# Altium schematic sheet 电调.SchDoc
size A3; SheetNumber: 1; SheetTotal: 1
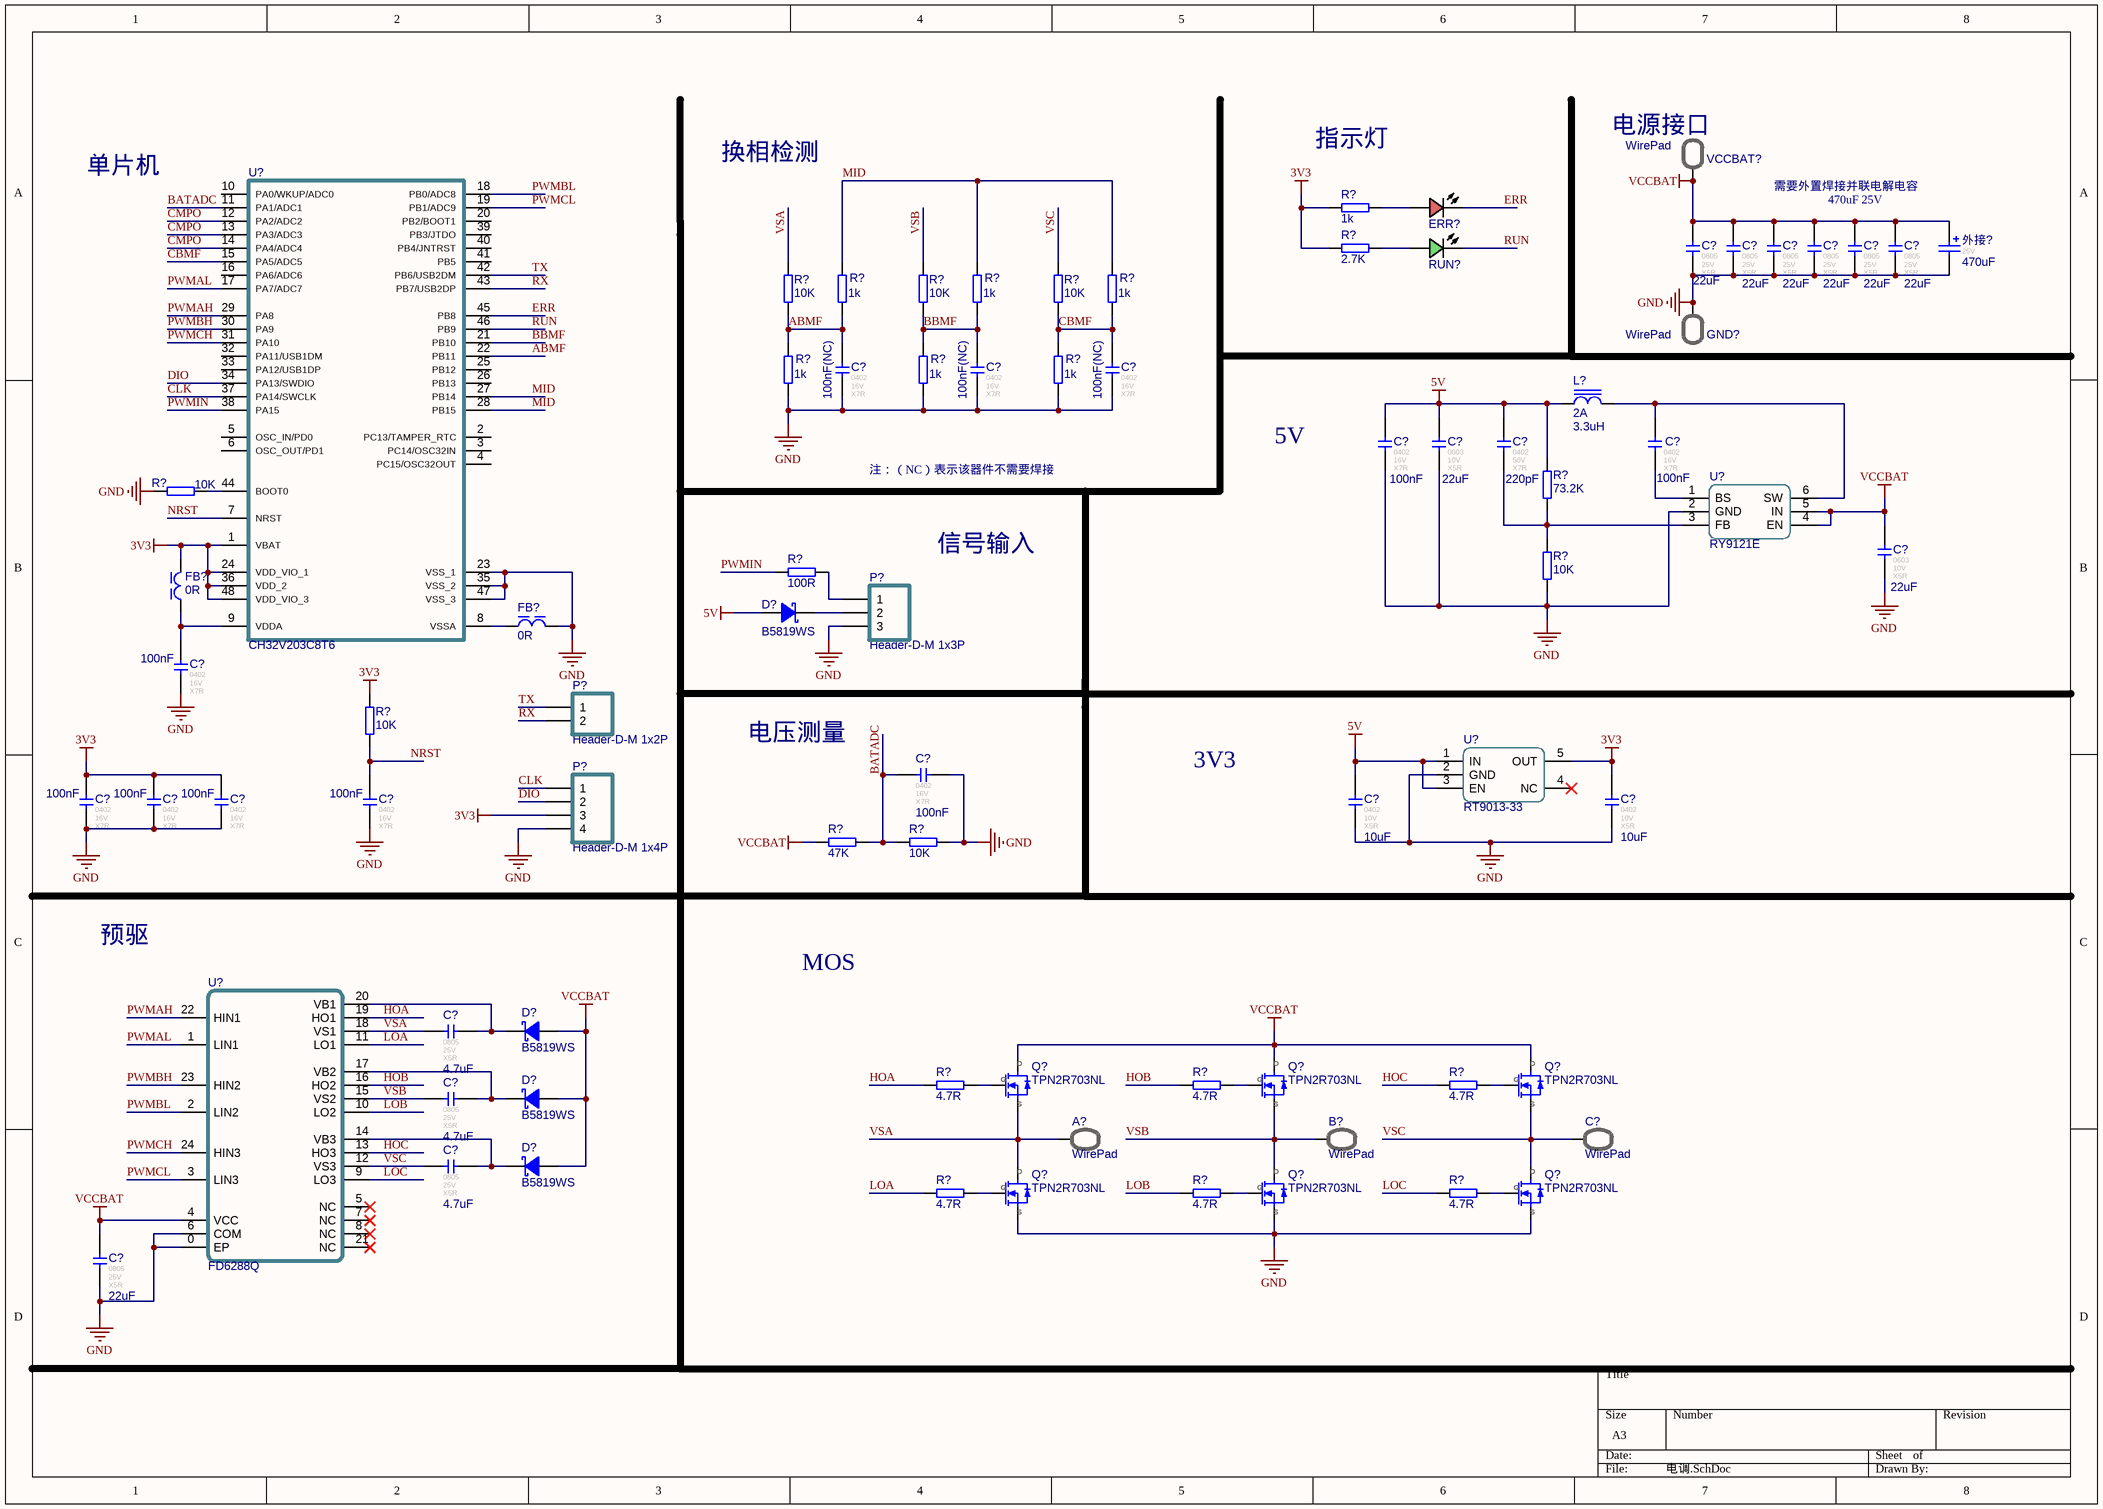
[diagram p0: 电调.SchDoc]

## Parts
(Parts that share a designator on the sheet are numbered #1, #2 ... from top to bottom, then left to right.)
A?  WirePad  [WirePad]  (no BOM)
B?  WirePad  [WirePad]  (no BOM)
C?#1  value 22uF  FootPrint: 0805  Voltage: 25V  Type: X5R  [CAPC2012[0805]S-L]  (hidden comment: 22uF 25V X5R)
C?#2  value 22uF  FootPrint: 0805  Voltage: 25V  Type: X5R  [CAPC2012[0805]S-L]  (hidden comment: 22uF 25V X5R)
C?#3  value 22uF  FootPrint: 0805  Voltage: 25V  Type: X5R  [CAPC2012[0805]S-L]  (hidden comment: 22uF 25V X5R)
C?#4  value 22uF  FootPrint: 0805  Voltage: 25V  Type: X5R  [CAPC2012[0805]S-L]  (hidden comment: 22uF 25V X5R)
C?#5  value 22uF  FootPrint: 0805  Voltage: 25V  Type: X5R  [CAPC2012[0805]S-L]  (hidden comment: 22uF 25V X5R)
C?#6  value 22uF  FootPrint: 0805  Voltage: 25V  Type: X5R  [CAPC2012[0805]S-L]  (hidden comment: 22uF 25V X5R)
C?#7  value 100nF(NC)  FootPrint: 0402  Voltage: 16V  Type: X7R  [CAPC1005[0402]S-L]  (hidden comment: 100nF(NC) 16V X7R)
C?#8  value 100nF(NC)  FootPrint: 0402  Voltage: 16V  Type: X7R  [CAPC1005[0402]S-L]  (hidden comment: 100nF(NC) 16V X7R)
C?#9  value 100nF(NC)  FootPrint: 0402  Voltage: 16V  Type: X7R  [CAPC1005[0402]S-L]  (hidden comment: 100nF(NC) 16V X7R)
C?#10  value 100nF  FootPrint: 0402  Voltage: 16V  Type: X7R  [CAPC1005[0402]S-L]  (hidden comment: 100nF 16V X7R)
C?#11  value 22uF  FootPrint: 0603  Voltage: 10V  Type: X5R  [CAPC1608[0603]S-L]  (hidden comment: 22uF 10V X5R)
C?#12  value 220pF  FootPrint: 0402  Voltage: 50V  Type: X7R  [CAPC1005[0402]S-L]  (hidden comment: 220pF 50V X7R)
C?#13  value 100nF  FootPrint: 0402  Voltage: 16V  Type: X7R  [CAPC1005[0402]S-L]  (hidden comment: 100nF 16V X7R)
C?#14  value 22uF  FootPrint: 0603  Voltage: 10V  Type: X5R  [CAPC1608[0603]S-L]  (hidden comment: 22uF 10V X5R)
C?#15  value 100nF  FootPrint: 0402  Voltage: 16V  Type: X7R  [CAPC1005[0402]S-L]  (hidden comment: 100nF 16V X7R)
C?#16  value 100nF  FootPrint: 0402  Voltage: 16V  Type: X7R  [CAPC1005[0402]S-L]  (hidden comment: 100nF 16V X7R)
C?#17  value 100nF  FootPrint: 0402  Voltage: 16V  Type: X7R  [CAPC1005[0402]S-L]  (hidden comment: 100nF 16V X7R)
C?#18  value 100nF  FootPrint: 0402  Voltage: 16V  Type: X7R  [CAPC1005[0402]S-L]  (hidden comment: 100nF 16V X7R)
C?#19  value 100nF  FootPrint: 0402  Voltage: 16V  Type: X7R  [CAPC1005[0402]S-L]  (hidden comment: 100nF 16V X7R)
C?#20  value 100nF  FootPrint: 0402  Voltage: 16V  Type: X7R  [CAPC1005[0402]S-L]  (hidden comment: 100nF 16V X7R)
C?#21  value 10uF  FootPrint: 0402  Voltage: 10V  Type: X5R  [CAPC1005[0402]S-L]  (hidden comment: 10uF 10V X5R)
C?#22  value 10uF  FootPrint: 0402  Voltage: 10V  Type: X5R  [CAPC1005[0402]S-L]  (hidden comment: 10uF 10V X5R)
C?#23  value 4.7uF  FootPrint: 0805  Voltage: 25V  Type: X5R  [CAPC2012[0805]S-L]  (hidden comment: 4.7uF 25V X5R)
C?#24  value 4.7uF  FootPrint: 0805  Voltage: 25V  Type: X5R  [CAPC2012[0805]S-L]  (hidden comment: 4.7uF 25V X5R)
C?#25  WirePad  [WirePad]  (no BOM)
C?#26  value 4.7uF  FootPrint: 0805  Voltage: 25V  Type: X5R  [CAPC2012[0805]S-L]  (hidden comment: 4.7uF 25V X5R)
C?#27  value 22uF  FootPrint: 0805  Voltage: 25V  Type: X5R  [CAPC2012[0805]S-L]  (hidden comment: 22uF 25V X5R)
D?#1  B5819WS  [SOD-323]
D?#2  B5819WS  [SOD-323]
D?#3  B5819WS  [SOD-323]
D?#4  B5819WS  [SOD-323]
ERR?  红色贴片LED  [LEDC1608(0603)-L]  (value not drawn)
FB?#1  value 0R  [INDC1005[0402]S]  (hidden comment: 0R @100MHz 500mA)
FB?#2  value 0R  [INDC1005[0402]S]  (hidden comment: 0R @100MHz 500mA)
GND?  WirePad  [WirePad]  (no BOM)
L?  value 3.3uH  Imax: 2A  [SLO2520]  (hidden comment: 3.3uH 2A)
P?#1  Header-D-M 1x3P  [HEADER1X3]
P?#2  Header-D-M 1x2P  [HEADER1X2]  (no BOM)
P?#3  Header-D-M 1x4P  [HDR1X4-TP-NS]  (no BOM)
Q?#1  TPN2R703NL  [TSON3x3]
Q?#2  TPN2R703NL  [TSON3x3]
Q?#3  TPN2R703NL  [TSON3x3]
Q?#4  TPN2R703NL  [TSON3x3]
Q?#5  TPN2R703NL  [TSON3x3]
Q?#6  TPN2R703NL  [TSON3x3]
R?#1  value 1k  [RESC1005[0402]S-L]  (hidden comment: 1k ±1%)
R?#2  value 2.7K  [RESC1005[0402]S-L]  (hidden comment: 2.7K ±1%)
R?#3  value 10K  [RESC1005[0402]S-L]  (hidden comment: 10K ±1%)
R?#4  value 1k  [RESC1005[0402]S-L]  (hidden comment: 1k ±1%)
R?#5  value 10K  [RESC1005[0402]S-L]  (hidden comment: 10K ±1%)
R?#6  value 1k  [RESC1005[0402]S-L]  (hidden comment: 1k ±1%)
R?#7  value 10K  [RESC1005[0402]S-L]  (hidden comment: 10K ±1%)
R?#8  value 1k  [RESC1005[0402]S-L]  (hidden comment: 1k ±1%)
R?#9  value 1k  [RESC1005[0402]S-L]  (hidden comment: 1k ±1%)
R?#10  value 1k  [RESC1005[0402]S-L]  (hidden comment: 1k ±1%)
R?#11  value 1k  [RESC1005[0402]S-L]  (hidden comment: 1k ±1%)
R?#12  value 10K  [RESC1005[0402]S-L]  (hidden comment: 10K ±1%)
R?#13  value 73.2K  [RESC1005[0402]S-L]  (hidden comment: 73.2K ±1%)
R?#14  value 100R  [RESC1005[0402]S-L]  (hidden comment: 100R ±1%)
R?#15  value 10K  [RESC1005[0402]S-L]  (hidden comment: 10K ±1%)
R?#16  value 10K  [RESC1005[0402]S-L]  (hidden comment: 10K ±1%)
R?#17  value 47K  [RESC1005[0402]S-L]  (hidden comment: 47K ±1%)
R?#18  value 10K  [RESC1005[0402]S-L]  (hidden comment: 10K ±1%)
R?#19  value 4.7R  [RESC1005[0402]S-L]  (hidden comment: 4.7R ±1%)
R?#20  value 4.7R  [RESC1005[0402]S-L]  (hidden comment: 4.7R ±1%)
R?#21  value 4.7R  [RESC1005[0402]S-L]  (hidden comment: 4.7R ±1%)
R?#22  value 4.7R  [RESC1005[0402]S-L]  (hidden comment: 4.7R ±1%)
R?#23  value 4.7R  [RESC1005[0402]S-L]  (hidden comment: 4.7R ±1%)
R?#24  value 4.7R  [RESC1005[0402]S-L]  (hidden comment: 4.7R ±1%)
RUN?  翠绿贴片LED  [LEDC1608(0603)-L]  (value not drawn)
U?#1  CH32V203C8T6  [LQFP48_L]
U?#2  RY9121E  [SOT-23-6]
U?#3  RT9013-33  [SOT-23-5]
U?#4  FD6288Q  [QFN24-4x4]
VCCBAT?  WirePad  [WirePad]  (no BOM)
外接?  value 470uF  Voltage: 25V  [Cap-S-D 3.5-8x14-S]  (hidden comment: 470uF 25V 聚合物固态)

## Nets
3V3: C?#17.2 C?#18.2 C?#19.2 C?#22.2 FB?#1.2 P?#3.3 R?#1.1 R?#2.1 R?#16.2 U?#1.1(VBAT) U?#1.24(VDD_VIO_1) U?#1.36(VDD_2) U?#1.48(VDD_VIO_3) U?#3.5(OUT)
5V: C?#10.2 C?#11.2 C?#12.2 C?#21.2 D?#1.A L?.1 R?#13.2 U?#3.1(IN) U?#3.3(EN)
GND: C?#1.1 C?#2.1 C?#3.1 C?#4.1 C?#5.1 C?#6.1 C?#7.1 C?#8.1 C?#9.1 C?#10.1 C?#11.1 C?#14.1 C?#15.1 C?#16.1 C?#17.1 C?#18.1 C?#19.1 C?#20.1 C?#21.1 C?#22.1 C?#27.1 FB?#2.2 GND?.1 P?#1.3 P?#3.4 Q?#4.3(S) Q?#5.3(S) Q?#6.3(S) R?#9.1 R?#10.1 R?#11.1 R?#12.1 R?#15.1 R?#18.1 U?#1.23(VSS_1) U?#1.35(VSS_2) U?#1.47(VSS_3) U?#2.2(GND) U?#3.2(GND) U?#4.0(EP) U?#4.6(COM) 外接?.2
VCCBAT: C?#1.2 C?#2.2 C?#3.2 C?#4.2 C?#5.2 C?#6.2 C?#14.2 C?#27.2 D?#2.A D?#3.A D?#4.A Q?#1.1(D) Q?#2.1(D) Q?#3.1(D) R?#17.2 U?#2.4(EN) U?#2.5(IN) U?#4.4(VCC) VCCBAT?.1 外接?.1
ABMF: C?#7.2 R?#3.1 R?#4.1 R?#9.2 U?#1.22(PB11)
BATADC: C?#16.2 R?#17.1 R?#18.2 U?#1.11(PA1/ADC1)
BBMF: C?#8.2 R?#5.1 R?#6.1 R?#10.2 U?#1.21(PB10)
CBMF: C?#9.2 R?#7.1 R?#8.1 R?#11.2 U?#1.15(PA5/ADC5)
CLK: P?#3.1 U?#1.37(PA14/SWCLK)
CMPO: U?#1.12(PA2/ADC2) U?#1.13(PA3/ADC3) U?#1.14(PA4/ADC4)
DIO: P?#3.2 U?#1.34(PA13/SWDIO)
ERR: ERR?.C U?#1.45(PB8)
HOA: R?#19.1 U?#4.19(HO1)
HOB: R?#20.1 U?#4.16(HO2)
HOC: R?#21.1 U?#4.13(HO3)
LOA: R?#22.1 U?#4.11(LO1)
LOB: R?#23.1 U?#4.10(LO2)
LOC: R?#24.1 U?#4.9(LO3)
MID: R?#4.2 R?#6.2 R?#8.2 U?#1.27(PB14) U?#1.28(PB15)
NRST: C?#20.2 R?#16.1 U?#1.7(NRST)
PWMAH: U?#1.29(PA8) U?#4.22(HIN1)
PWMAL: U?#1.17(PA7/ADC7) U?#4.1(LIN1)
PWMBH: U?#1.30(PA9) U?#4.23(HIN2)
PWMBL: U?#1.18(PB0/ADC8) U?#4.2(LIN2)
PWMCH: U?#1.31(PA10) U?#4.24(HIN3)
PWMCL: U?#1.19(PB1/ADC9) U?#4.3(LIN3)
PWMIN: R?#14.1 U?#1.38(PA15)
RUN: RUN?.C U?#1.46(PB9)
RX: P?#2.2 U?#1.43(PB7/USB2DP)
TX: P?#2.1 U?#1.42(PB6/USB2DM)
VSA: A?.1 C?#23.1 Q?#1.3(S) Q?#4.1(D) R?#3.2 U?#4.18(VS1)
VSB: B?.1 C?#24.1 Q?#2.3(S) Q?#5.1(D) R?#5.2 U?#4.15(VS2)
VSC: C?#25.1 C?#26.1 Q?#3.3(S) Q?#6.1(D) R?#7.2 U?#4.12(VS3)
NetC?#12_1: C?#12.1 R?#13.1 R?#15.2 U?#2.3(FB)
NetC?#13_1: C?#13.1 U?#2.1(BS)
NetC?#13_2: C?#13.2 L?.2 U?#2.6(SW)
NetC?#15_2: C?#15.2 FB?#1.1 U?#1.9(VDDA)
NetC?#23_2: C?#23.2 D?#2.K U?#4.20(VB1)
NetC?#24_2: C?#24.2 D?#3.K U?#4.17(VB2)
NetC?#26_2: C?#26.2 D?#4.K U?#4.14(VB3)
NetD?#1_K: D?#1.K P?#1.2
NetERR?_A: ERR?.A R?#1.2
NetFB?#2_1: FB?#2.1 U?#1.8(VSSA)
NetP?#1_1: P?#1.1 R?#14.2
NetQ?#1_2: Q?#1.2(G) R?#19.2
NetQ?#2_2: Q?#2.2(G) R?#20.2
NetQ?#3_2: Q?#3.2(G) R?#21.2
NetQ?#4_2: Q?#4.2(G) R?#22.2
NetQ?#5_2: Q?#5.2(G) R?#23.2
NetQ?#6_2: Q?#6.2(G) R?#24.2
NetR?#2_2: R?#2.2 RUN?.A
NetR?#12_2: R?#12.2 U?#1.44(BOOT0)

Not connected (* = marked no-connect by the designer): U?#1 2(PC13/TAMPER_RTC) 3(PC14/OSC32IN) 4(PC15/OSC32OUT) 5(OSC_IN/PD0) 6(OSC_OUT/PD1) 10(PA0/WKUP/ADC0) 16(PA6/ADC6) 20(PB2/BOOT1) 25(PB12) 26(PB13) 32(PA11/USB1DM) 33(PA12/USB1DP) 39(PB3/JTDO) 40(PB4/JNTRST) 41(PB5); U?#3 4(NC)*; U?#4 5(NC)* 7(NC)* 8(NC)* 21(NC)*

## Notes on the sheet
- 单片机
- 换相检测
- 指示灯
- (near VCCBAT?) 电源接口
- (near C?#3) 需要外置焊接并联电解电容
- (near C?#5) 470uF 25V
- 5V
- 注：（NC）表示该器件不需要焊接
- 信号输入
- 电压测量
- 3V3
- 预驱
- MOS

## Library data of the parts
A? B? C?#25 GND? VCCBAT? = WirePad: 线缆焊盘
C?#1-C?#6 C?#27 = 22uF 0805 25V X5R: 贴片瓷片电容; MLCC; 0805(2012);; Revision: V1.0
C?#7-C?#10 C?#13 C?#15-C?#20 = 100nF 0402 16V X7R: 贴片瓷片电容; MLCC; 0402(1005);; Revision: V1.0
C?#11 C?#14 = 22uF 0603 10V X5R: 贴片瓷片电容; MLCC; 0603(1608);; Revision: V1.0
C?#12 = 220pF 0402 50V X7R: 贴片瓷片电容; MLCC; 0402(1005);; Revision: V1.0
C?#21 C?#22 = 10uF 0402 10V X5R: 贴片瓷片电容; MLCC; 0402(1005);; Revision: V1.0
C?#23 C?#24 C?#26 = 4.7uF 0805 25V X5R: 贴片瓷片电容; MLCC; 0805(2012);; Revision: V1.0
D?#1-D?#4 = B5819WS: B5819WS 肖特基二极管; Revision: V1.0; Value: B5819WS
ERR? = LED Chip Red: Published: 8-Jun-2000; Revision: July-2002: Re-released for DXP Platform.; Publisher: Altium Limited; Price(RMB): 0.00
FB?#1 FB?#2 = FB-Chip: 贴片磁珠; DCR: .1m; Published: 2020-12-18; Revision: V1.0; Frequency: @100MHz; Imax: 500mA
L? = Ind-Power: 功率电感; DCR: .5m; Published: 8-Jun-2000; Revision: July-2002: Re-released for DXP Platform.; Publisher: Altium Limited; Price(RMB): 0.000
P?#1 = Header-D-M 1x3P: 1x3pin, 直插, 排针; Revision: V1.0; Value: Header-D-M 1x3P
P?#2 = Header-D-M 1x2P: 1x2pin, 直插, 排针; Revision: V1.0; Value: Header-D-M 1x2P
P?#3 = Header-D-M 1x4P: 1x4pin, 直插, 排针; Revision: V1.0; Value: Header-D-M 1x4P
Q?#1-Q?#6 = TPN2R703NL: 东芝 N沟 MOS
R?#1 R?#4 R?#6 R?#8-R?#11 = Res-Chip_1: 贴片电阻; Revision: V1.0; Tolerance: ±1%
R?#2 = Res-Chip_4: 贴片电阻; Revision: V1.0; Tolerance: ±1%
R?#3 R?#5 R?#7 R?#12 R?#15 R?#16 R?#18 = Res-Chip: 贴片电阻; Revision: V1.0; Tolerance: ±1%
R?#13 = Res-Chip_5: 贴片电阻; Revision: V1.0; Tolerance: ±1%
R?#14 = Res-Chip_2: 贴片电阻; Revision: V1.0; Tolerance: ±1%
R?#17 = Res-Chip_3: 贴片电阻; Revision: V1.0; Tolerance: ±1%
R?#19-R?#24 = Res-Chip_6: 贴片电阻; Revision: V1.0; Tolerance: ±1%
RUN? = LED Chip Green: Published: 8-Jun-2000; Revision: July-2002: Re-released for DXP Platform.; Publisher: Altium Limited; Price(RMB): 0.00
U?#1 = CH32V203CxT6: 沁恒青稞32位RISC-V内核单片机 LQFP-48; Published: 30-May-2008; DatasheetVersion: rev6, Mar-2008; PackageVersion: Mar-2008; PackageReference: LQFP48; Publisher: Altium Limited; PackageDescription: 48-Pin Low-Profile Quad Flat Pack, 7 x 7 mm Body, 0.5 mm Pitch (LQFP48); ComponentLink1Description: Manufacturer Link; ComponentLink1URL: www.st.com/stm32; ComponentLink2Description: Datasheet; ComponentLink2URL: http://www.st.com/stonline/products/literature/ds/13587.pdf
U?#2 = RY9121E: 17V 2A 1.2MHz Synchronous Step-Down Regulator; Revision: V1.0; Value: RY9121E
U?#3 = RT9013-33: 3.3V 500mA SOT-23-5 LDO
U?#4 = FD6288Q: FD6288Q 三相栅极驱动器
外接? = S-D 470uF 25V 8x12: 直插固态电容 470uF 25V 8x12; Revision: V1.0; Type: 聚合物固态